# Altium schematic sheet imxbbaudio.SchDoc: IMXBB
size A3; DocumentNumber: 3; Revision: 2.0; SheetNumber: 3; SheetTotal: 9
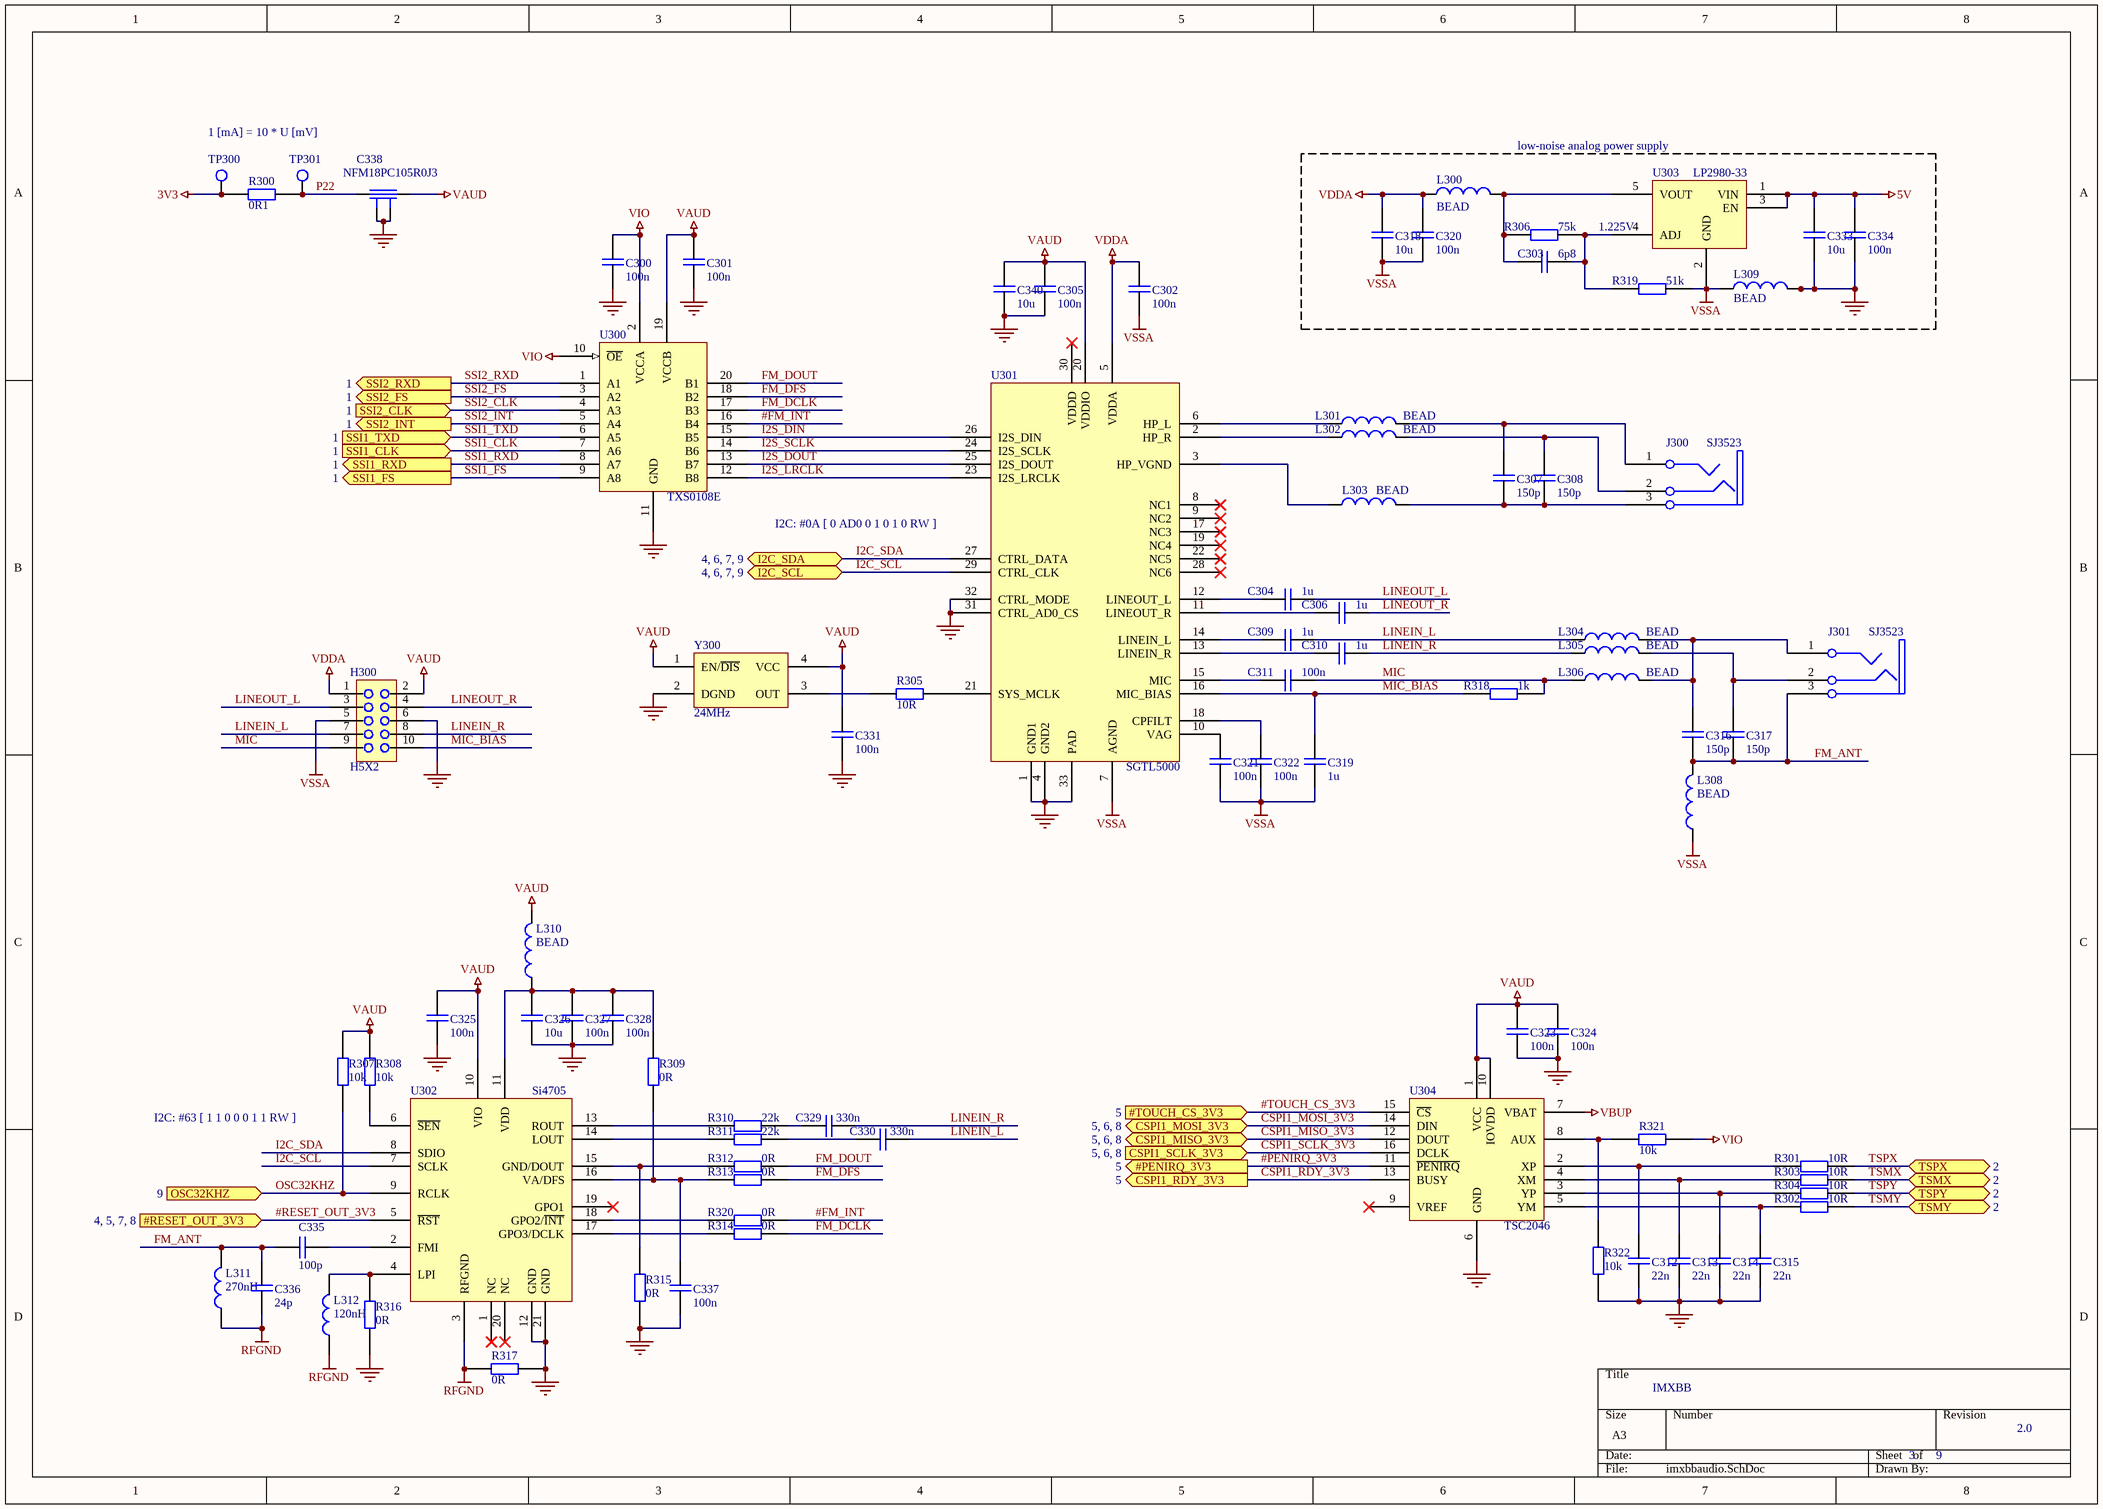
[diagram p0: imxbbaudio.SchDoc]

## Parts
C300  100n  [0603]
C301  100n  [0603]
C302  100n  [0603]
C303  6p8  [0603]
C304  1u  [0603]
C305  100n  [0603]
C306  1u  [0603]
C307  150p  [0603]
C308  150p  [0603]
C309  1u  [0603]
C310  1u  [0603]
C311  100n  [0603]
C312  22n  [0603]
C313  22n  [0603]
C314  22n  [0603]
C315  22n  [0603]
C316  150p  [0603]
C317  150p  [0603]
C318  10u  [0805]
C319  1u  [0603]
C320  100n  [0603]
C321  100n  [0603]
C322  100n  [0603]
C323  100n  [0603]
C324  100n  [0603]
C325  100n  [0603]
C326  10u  [0805]
C327  100n  [0603]
C328  100n  [0603]
C329  330n  [0603]
C330  330n  [0603]
C331  100n  [0603]
C333  10u  [0805]
C334  100n  [0603]
C335  100p  [0603]
C336  24p  [0603]
C337  100n  [0603]
C338  NFM18PC105R0J3  [NFM18P]
C340  10u  [0805]
H300  H5X2  [H2x5]
J300  SJ3523  [SJ35_NS]
J301  SJ3523  [SJ35_NS]
L300  BEAD  [0603]
L301  BEAD  [0603]
L302  BEAD  [0603]
L303  BEAD  [0603]
L304  BEAD  [0603]
L305  BEAD  [0603]
L306  BEAD  [0603]
L308  BEAD  [0603]
L309  BEAD  [0603]
L310  BEAD  [0603]
L311  270nH  [0603]
L312  120nH  [0603]
R300  0R1  [0603]
R301  10R  [0603]
R302  10R  [0603]
R303  10R  [0603]
R304  10R  [0603]
R305  10R  [0603]
R306  75k  [0603]
R307  10k  [0603]
R308  10k  [0603]
R309  0R  [0603]
R310  22k  [0603]
R311  22k  [0603]
R312  0R  [0603]
R313  0R  [0603]
R314  0R  [0603]
R315  0R  [0603]
R316  0R  [0603]
R317  0R  [0603]
R318  1k  [0603]
R319  51k  [0603]
R320  0R  [0603]
R321  10k  [0603]
R322  10k  [0603]
TP300  TESTPOINT  [TESTPOINT_2mm]  (value not drawn)
TP301  TESTPOINT  [TESTPOINT_2mm]  (value not drawn)
U300  TXS0108E  [TSSOP20]
U301  SGTL5000  [QFN32]
U302  Si4705  [QFN20]
U303  LP2980-33  [SOT23-5]
U304  TSC2046  [TSSOP16]
Y300  24MHz  [JO75]

## Ports
#PENIRQ_3V3 (out, see 5), #RESET_OUT_3V3 (in, see 4, 5, 7, 8), #TOUCH_CS_3V3 (in, see 5), CSPI1_MISO_3V3 (bidir, see 5, 6, 8), CSPI1_MOSI_3V3 (bidir, see 5, 6, 8), CSPI1_RDY_3V3 (out, see 5), CSPI1_SCLK_3V3 (in, see 5, 6, 8), I2C_SCL (bidir, see 4, 6, 7, 9), I2C_SDA (bidir, see 4, 6, 7, 9), OSC32KHZ (in, see 9), SSI1_CLK (in, see 1), SSI1_FS (out, see 1), SSI1_RXD (out, see 1), SSI1_TXD (in, see 1), SSI2_CLK (in, see 1), SSI2_FS (out, see 1), SSI2_INT (out, see 1), SSI2_RXD (out, see 1), TSMX (see 2), TSMY (see 2), TSPX (see 2), TSPY (see 2)

## Nets
3V3: R300.1 TP300.1
5V: C333.2 C334.2 U303.1(VIN) U303.3(EN)
GND: C300.1 C301.1 C305.1 C312.1 C313.1 C314.1 C315.1 C323.1 C324.1 C325.1 C326.1 C327.1 C328.1 C331.1 C333.1 C334.1 C337.1 C338.2 C338.4 C340.1 H300.6 L309.1 R315.1 R316.1 R317.1 R322.1 U300.11(GND) U301.1(GND1) U301.4(GND2) U301.31(CTRL_AD0_CS) U301.32(CTRL_MODE) U301.33(PAD) U302.12(GND) U302.21(GND) U304.6(GND) Y300.2(DGND)
RFGND: C336.2 L311.1 L312.1 R317.2 U302.3(RFGND)
VAUD: C301.2 C305.2 C323.2 C324.2 C325.2 C331.2 C338.3 C340.2 H300.2 L310.2 R307.2 R308.2 U300.19(VCCB) U301.20(VDDIO) U302.10(VIO) U304.1(VCC) U304.10(IOVDD) Y300.1(EN/~{DIS}) Y300.4(VCC)
VBUP: U304.7(VBAT)
VDDA: C302.2 C318.2 C320.2 H300.1 L300.1 U301.5(VDDA)
VIO: C300.2 R321.1 U300.2(VCCA) U300.10(~{OE})
VSSA: C302.1 C318.1 C319.2 C320.1 C321.1 C322.1 H300.5 L308.1 L309.2 R319.1 U301.7(AGND) U303.2(GND)
#FM_INT: R320.1 U300.16(B4)
#PENIRQ_3V3: U304.11(~{PENIRQ}) ; port #PENIRQ_3V3
#RESET_OUT_3V3: U302.5(~{RST}) ; port #RESET_OUT_3V3
#TOUCH_CS_3V3: U304.15(~{CS}) ; port #TOUCH_CS_3V3
CSPI1_MISO_3V3: U304.12(DOUT) ; port CSPI1_MISO_3V3
CSPI1_MOSI_3V3: U304.14(DIN) ; port CSPI1_MOSI_3V3
CSPI1_RDY_3V3: U304.13(BUSY) ; port CSPI1_RDY_3V3
CSPI1_SCLK_3V3: U304.16(DCLK) ; port CSPI1_SCLK_3V3
FM_ANT: C316.1 C317.1 C335.2 C336.1 J301.3 L308.2 L311.2
FM_DCLK: R314.1 U300.17(B3)
FM_DFS: R313.1 U300.18(B2)
FM_DOUT: R312.1 U300.20(B1)
I2C_SCL: U301.29(CTRL_CLK) U302.7(SCLK) ; port I2C_SCL
I2C_SDA: U301.27(CTRL_DATA) U302.8(SDIO) ; port I2C_SDA
I2S_DIN: U300.15(B5) U301.26(I2S_DIN)
I2S_DOUT: U300.13(B7) U301.25(I2S_DOUT)
I2S_LRCLK: U300.12(B8) U301.23(I2S_LRCLK)
I2S_SCLK: U300.14(B6) U301.24(I2S_SCLK)
LINEIN_L: C309.1 C330.1 H300.7 L304.1
LINEIN_R: C310.1 C329.1 H300.8 L305.1
LINEOUT_L: C304.1 H300.3
LINEOUT_R: C306.1 H300.4
MIC: C311.1 H300.9 L306.1 R318.1
MIC_BIAS: C319.1 H300.10 R318.2 U301.16(MIC_BIAS)
OSC32KHZ: R307.1 U302.9(RCLK) ; port OSC32KHZ
P22: C338.1 R300.2 TP301.1
SSI1_CLK: U300.7(A6) ; port SSI1_CLK
SSI1_FS: U300.9(A8) ; port SSI1_FS
SSI1_RXD: U300.8(A7) ; port SSI1_RXD
SSI1_TXD: U300.6(A5) ; port SSI1_TXD
SSI2_CLK: U300.4(A3) ; port SSI2_CLK
SSI2_FS: U300.3(A2) ; port SSI2_FS
SSI2_INT: U300.5(A4) ; port SSI2_INT
SSI2_RXD: U300.1(A1) ; port SSI2_RXD
TSMX: R303.2 ; port TSMX
TSMY: R302.2 ; port TSMY
TSPX: R301.2 ; port TSPX
TSPY: R304.2 ; port TSPY
NetC303_1: C303.1 R306.1 R319.2 U303.4(ADJ)
NetC303_2: C303.2 L300.2 R306.2 U303.5(VOUT)
NetC304_2: C304.2 U301.12(LINEOUT_L)
NetC306_2: C306.2 U301.11(LINEOUT_R)
NetC307_1: C307.1 C308.1 J300.3 L303.2
NetC307_2: C307.2 J300.1 L301.2
NetC308_2: C308.2 J300.2 L302.2
NetC309_2: C309.2 U301.14(LINEIN_L)
NetC310_2: C310.2 U301.13(LINEIN_R)
NetC311_2: C311.2 U301.15(MIC)
NetC312_2: C312.2 R301.1 U304.2(XP)
NetC313_2: C313.2 R303.1 U304.4(XM)
NetC314_2: C314.2 R304.1 U304.3(YP)
NetC315_2: C315.2 R302.1 U304.5(YM)
NetC316_2: C316.2 J301.1 L304.2 L306.2
NetC317_2: C317.2 J301.2 L305.2
NetC321_2: C321.2 U301.10(VAG)
NetC322_2: C322.2 U301.18(CPFILT)
NetC326_2: C326.2 C327.2 C328.2 L310.1 R309.2 U302.11(VDD)
NetC329_2: C329.2 R310.1
NetC330_2: C330.2 R311.1
NetC335_1: C335.1 U302.2(FMI)
NetC337_2: C337.2 R309.1 R313.2 U302.16(VA/DFS)
NetL301_1: L301.1 U301.6(HP_L)
NetL302_1: L302.1 U301.2(HP_R)
NetL303_1: L303.1 U301.3(HP_VGND)
NetL312_2: L312.2 R316.2 U302.4(LPI)
NetR305_1: R305.1 Y300.3(OUT)
NetR305_2: R305.2 U301.21(SYS_MCLK)
NetR308_1: R308.1 U302.6(~{SEN})
NetR310_2: R310.2 U302.13(ROUT)
NetR311_2: R311.2 U302.14(LOUT)
NetR312_2: R312.2 R315.2 U302.15(GND/DOUT)
NetR314_2: R314.2 U302.17(GPO3/DCLK)
NetR320_2: R320.2 U302.18(GPO2/~{INT})
NetR321_2: R321.2 R322.2 U304.8(AUX)

Not connected (* = marked no-connect by the designer): U301 8(NC1)* 9(NC2)* 17(NC3)* 19(NC4)* 22(NC5)* 28(NC6)* 30(VDDD)*; U302 1(NC)* 19(GPO1)* 20(NC)*; U304 9(VREF)*

## Notes on the sheet
- 1 [mA] = 10 * U [mV]
- low-noise analog power supply
- (near U303) 1.225V
- (near U301) I2C: #0A [ 0 AD0 0 1 0 1 0 RW ]
- I2C: #63 [ 1 1 0 0 0 1 1 RW ]

## Library data of the parts
C300-C331 C333-C337 C340 = C
C338 = NFL21S: Chip EMIFIL; Producer: Murata; Order number: NFM18PC105R0J3; Component class: C; Assembly type: SMT
L300-L306 L308-L310 = FBEAD
L311 L312 = L
R300-R322 = R
TP300 TP301 = TESTPOINT: Testpoint pad; Order number: no component; Component class: TP; Producer: n/a; Assembly type: no component
U302 = Si470x
U303 = LP2980
Y300 = OSC